# Altium schematic sheet 1_Power.SchDoc
size A3; DocumentNumber: 2; SheetNumber: 2; SheetTotal: 6
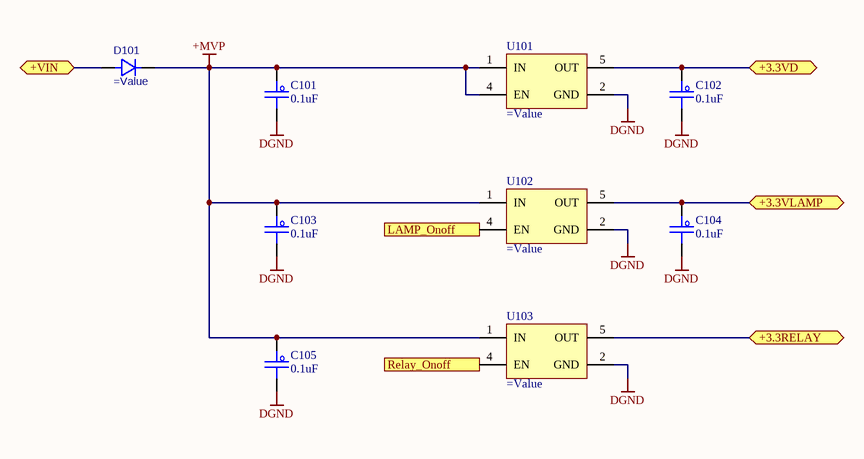
[diagram p0: 1_Power.SchDoc]

## Parts
C101  0.1uF  [C_0603]
C102  0.1uF  [C_0603]
C103  0.1uF  [C_0603]
C104  0.1uF  [C_0603]
C105  0.1uF  [C_0603]
D101  (no value)  [SOD323]
U101  (no value)  [SOT95P280X145-5N]
U102  (no value)  [SOT95P280X145-5N]
U103  (no value)  [SOT95P280X145-5N]

## Ports
+3.3RELAY (bidir), +3.3VD (bidir), +3.3VLAMP (bidir), +VIN (bidir), LAMP_Onoff (in), Relay_Onoff (in)

## Nets
+MVP: C101.1 C103.1 C105.1 D101.1 U101.1(IN) U101.4(EN) U102.1(IN) U103.1(IN)
DGND: C101.2 C102.2 C103.2 C104.2 C105.2 U101.2(GND) U102.2(GND) U103.2(GND)
+3.3RELAY: U103.5(OUT) ; port +3.3RELAY
+3.3VD: C102.1 U101.5(OUT) ; port +3.3VD
+3.3VLAMP: C104.1 U102.5(OUT) ; port +3.3VLAMP
+VIN: D101.2 ; port +VIN
LAMP_Onoff: U102.4(EN) ; port LAMP_Onoff
Relay_Onoff: U103.4(EN) ; port Relay_Onoff

## Notes on the sheet
- Title :
- Revision :
- ผู้จัดทำ:
- Size:
- A3
- Time:
- ผู้เขียน:
- บริษัท ยูนิเวอร์แซล ยูทีลิตี้ส์ จำกัด (มหาชน) เลขที่ 1 อาคาร อีสท์วอเตอร์ ชั้น 18 ซอยวิภาวดีรังสิต 5 แขวงจอมพล เขตจตุจักร กรุงเทพฯ 10900
  Tel : +662-272-1688
  Fax :+662-2721690-1
- -
- Sheet:
- of
- ผู้อำนวยการ
- ผู้ตรวจสอบ:
- Number:
- กรรมการผู้จัดการ:
- File:

## Library data of the parts
C101-C105 = C_Capacitor: CAP CER 0.1UF 50V X7R 0603; Manufacturer: KEMET; PartNumber: C0603C104K5RACTU; PackageReference: 0603; PartID: 399-5089-1-ND; Value2: 50V; Value: 0.1uF; Value3: *
D101 = D_PW_SD103AWS: DIODE SCHOTTKY 40V 2A 0603; Manufacturer: Slkor(SLKORMICRO Elec.); Value: SD103AWS; PackageReference: SOD-323; PartID: C513472; PartNumber: SD103AWS
U101-U103 = IC_LDO_RT9069-33GB: 200mA 360mV@(10mA) Fixed 3.3V~3.3V Positive 1 36V SOT-23-5 Linear Voltage Regulators (LDO) ROHS; Manufacturer: Richtek Tech; PartNumber: RT9069-33GB; PartID: C147969; PackageReference: SOT-23-5; Value: RT9069-33GB; Value2: *; Value3: *